# Altium project Altium.PrjPcb
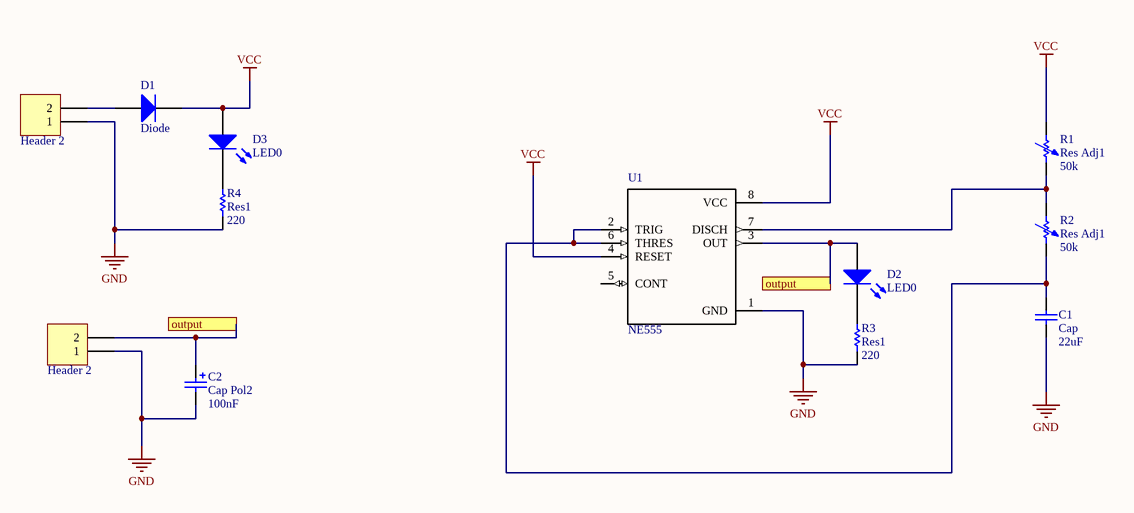
[diagram p0: Sheet1.SchDoc]
1 sheet, 12 parts. Net scope: flat (ports and power ports of the same name join across sheets).
Board file: PCB1.PcbDoc

## Sheet Sheet1.SchDoc
size A4

### Parts
C1  Cap  value 22uF  [RAD-0.2]
C2  Cap Pol2  value 100nF  [RAD-0.2]
D1  Diode  [DIODE-0.4]
D2  LED0  [HDR1X2]
D3  LED0  [HDR1X2]
P1  Header 2  [CN_KRE_2]
P2  Header 2  [CN_KRE_2]
R1  Res Adj1  value 50k  [CN_KRE_3]
R2  Res Adj1  value 50k  [CN_KRE_3]
R3  Res1  value 220  [AXIAL-0.3]
R4  Res1  value 220  [AXIAL-0.3]
U1  NE555  [*DIP794W45P254L1060H508Q8]

### Ports
output

### Nets
GND: C1.1 C2.2 P1.1 P2.1 R3.1 R4.1 U1.1(GND)
VCC: D1.2(K) D3.1(A) R1.1 U1.4(RESET) U1.8(VCC)
NetC1_2: C1.2 R2.2 U1.2(TRIG) U1.6(THRES)
NetC2_1: C2.1 D2.1(A) P2.2 U1.3(OUT) ; port output
NetD1_1: D1.1(A) P1.2
NetD2_2: D2.2(K) R3.2
NetD3_2: D3.2(K) R4.2
NetR1_2: R1.2 R2.1 U1.7(DISCH)

Not connected (* = marked no-connect by the designer): U1 5(CONT)

### Library data of the parts
C1 = Cap: Capacitor; Published: 8-Jun-2000; LatestRevisionDate: 17-Jul-2002; LatestRevisionNote: Re-released for DXP Platform.; PackageReference: RAD-0.3; Publisher: Altium Limited; PackageDescription: Radial Cap, Thru-Hole; 2 Leads; 0.3 in Pin Spacing
C2 = Cap Pol2: Polarized Capacitor (Axial); Published: 8-Jun-2000; LatestRevisionDate: 17-Jul-2002; LatestRevisionNote: Re-released for DXP Platform.; PackageReference: POLAR0.8; Publisher: Altium Limited; PackageDescription: Polarized Capacitor; 2 Leads
D1 = Diode: Default Diode; Published: 8-Jun-2000; LatestRevisionDate: 17-Jul-2002; LatestRevisionNote: Re-released for DXP Platform.; PackageVersion: Sep-1996; PackageReference: SMC; Publisher: Altium Limited; PackageDescription: DO-214-AB/SMC; 2 C-Bend Leads; Body 7.9 x 5.9 mm, inc. leads (LxW); Code_JEDEC: DO-214-AB
D2 D3 = LED0: Typical INFRARED GaAs LED; Published: 8-Jun-2000; LatestRevisionDate: 08-Jul-2005; LatestRevisionNote: Mech Layer 1 removed.; PackageReference: LED-0; Publisher: Altium Limited; PackageDescription: LED; 2 Leads
P1 P2 = Header 2: Header, 2-Pin; LatestRevisionDate: 17-Jul-2002; LatestRevisionNote: Re-released for DXP Platform.; Publisher: Altium Limited
R1 R2 = Res Adj1: Variable Resistor; Set Position: 0.5; Published: 8-Jun-2000; LatestRevisionDate: 17-Jul-2002; LatestRevisionNote: Re-released for DXP Platform.; PackageReference: AXIAL-0.7; Publisher: Altium Limited; PackageDescription: Axial Device, Thru-Hole; 2 Leads; 0.7 in Pin Spacing
R3 R4 = Res1: Resistor; Published: 8-Jun-2000; LatestRevisionDate: 17-Jul-2002; LatestRevisionNote: Re-released for DXP Platform.; PackageReference: AXIAL-0.3; Publisher: Altium Limited; PackageDescription: Axial Device, Thru-Hole; 2 Leads; 0.3 in Pin Spacing
U1 = NE555: MF: Texas Instruments; MP: NE555; SnapEDA_Link: https://www.snapeda.com/parts/NE555/Texas%20Instruments/view-part/?ref=snap; Package: SOIC-8 Conrad; Digi-Key_Part_Number: 296-6501-1-ND; Digi-Key_Purchase_URL: https://www.digikey.com.br/product-detail/en/texas-instruments/NE555DR/296-6501-1-ND/372490?utm_source=snapeda&utm_medium=aggregator&utm_campaign=symbol; Value: *